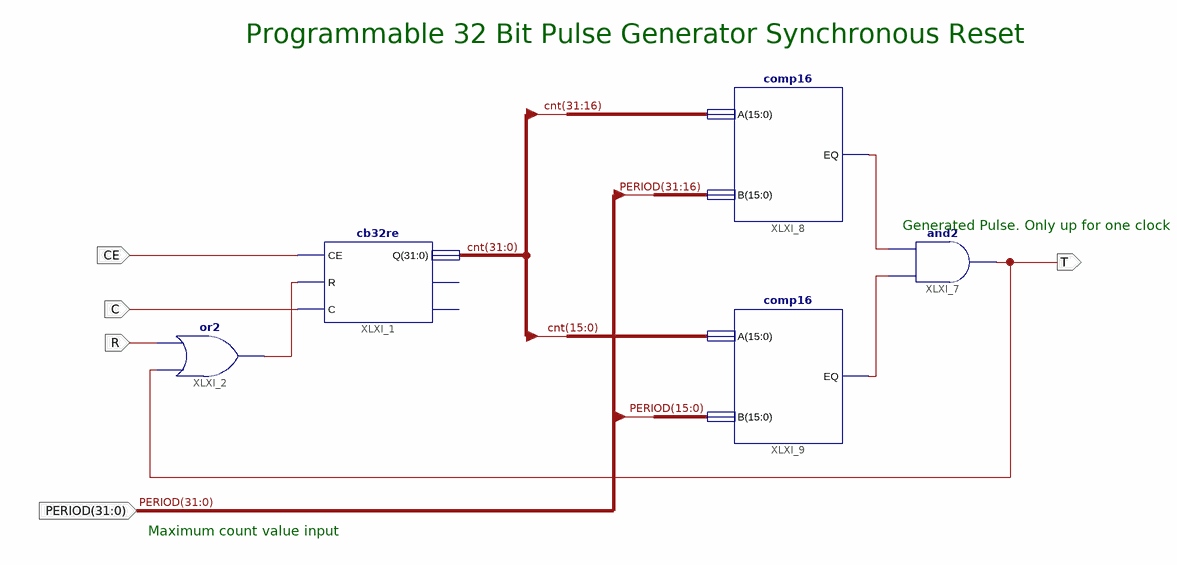
[diagram p0: schematic sheet 1]
// Xilinx ISE schematic pg32re.sch (spartan6) as structural Verilog: 5 symbols, 5 ports
module pg32re (
  input  CE,
  input  C,
  input  [31:0] PERIOD,
  input  R,
  output T
);

  wire XLXN_2, XLXN_6, XLXN_7;
  wire [31:0] cnt;

  cb32re XLXI_1 (.C(C), .CE(CE), .Q(cnt), .R(XLXN_2));  // open: CEO, TC
  or XLXI_2 (XLXN_2, T, R);
  comp16 XLXI_9 (.A(cnt[15:0]), .B(PERIOD[15:0]), .EQ(XLXN_7));
  comp16 XLXI_8 (.A(cnt[31:16]), .B(PERIOD[31:16]), .EQ(XLXN_6));
  and XLXI_7 (T, XLXN_7, XLXN_6);

  // Notes on the sheet:
  //   Programmable 32 Bit Pulse Generator Synchronous Reset
  //   Generated Pulse. Only up for one clock
  //   Maximum count value input
endmodule
